# EAGLE design power (EAGLE 7.7.0)
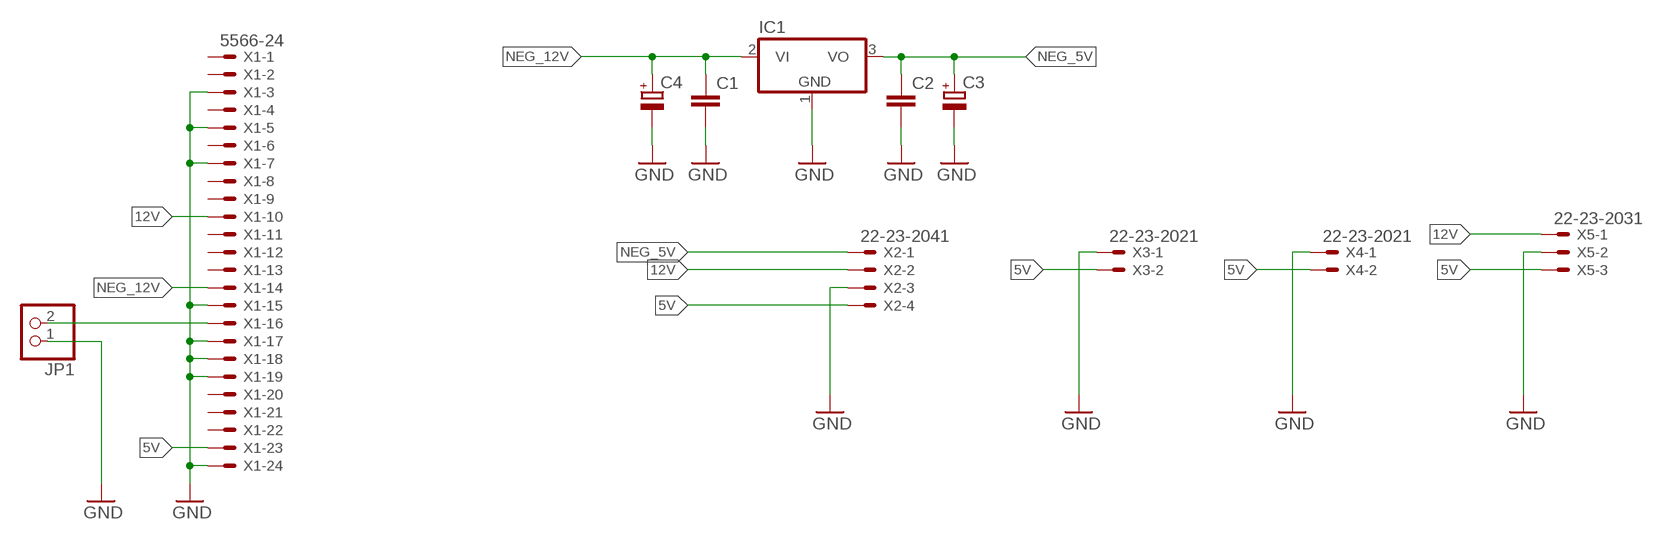
[diagram p0: schematic, sheet 1]

## Parts
C1  C-EUC1206  [C1206]
C2  C-EUC1206  [C1206]
C3  CPOL-EUSMCB  [SMC_B]
C4  CPOL-EUSMCB  [SMC_B]
IC1  7905T  [TO220H]
JP1  PINHD-1X2  [1X02]
X1  5566-24  [5566-24]
X2  22-23-2041  [22-23-2041]
X3  22-23-2021  [22-23-2021]
X4  22-23-2021  [22-23-2021]
X5  22-23-2031  [22-23-2031]

## Nets
5V: X1.23 X2.4 X3.2 X4.2 X5.3
12V: X1.10 X2.2 X5.1
GND: C1.2 C2.2 C3.- C4.- IC1.1(GND) JP1.1 X1.3 X1.5 X1.7 X1.15 X1.17 X1.18 X1.19 X1.24 X2.3 X3.1 X4.1 X5.2
N$1: JP1.2 X1.16
NEG_5V: C2.1 C3.+ IC1.3(VO) X2.1
NEG_12V: C1.1 C4.+ IC1.2(VI) X1.14
Unconnected: X1.1 X1.2 X1.4 X1.6 X1.8 X1.9 X1.11 X1.12 X1.13 X1.20 X1.21 X1.22

## Library data of the parts
C1 C2 = rcl:C-EU: CAPACITOR, European symbol
C3 C4 = rcl:CPOL-EU: POLARIZED CAPACITOR, European symbol
IC1 = linear:79*: Negative VOLTAGE REGULATOR
JP1 = pinhead:PINHD-1X2: PIN HEADER
X1 = con-molex:5566-24: Mini FIT connector 24 pol Source: http://www.molex.com; OC_FARNELL: unknown; OC_NEWARK: unknown
X2 = con-molex:22-23-2041: .100" (2.54mm) Center Header - 4 Pin; MF: MOLEX; MPN: 22-23-2041; OC_FARNELL: 1462920; OC_NEWARK: 38C0355
X3 X4 = con-molex:22-23-2021: .100" (2.54mm) Center Header - 2 Pin; MF: MOLEX; MPN: 22-23-2021; OC_FARNELL: 1462926; OC_NEWARK: 25C3832
X5 = con-molex:22-23-2031: .100" (2.54mm) Center Header - 3 Pin; MF: MOLEX; MPN: 22-23-2031; OC_FARNELL: 1462950; OC_NEWARK: 30C0862

## Board
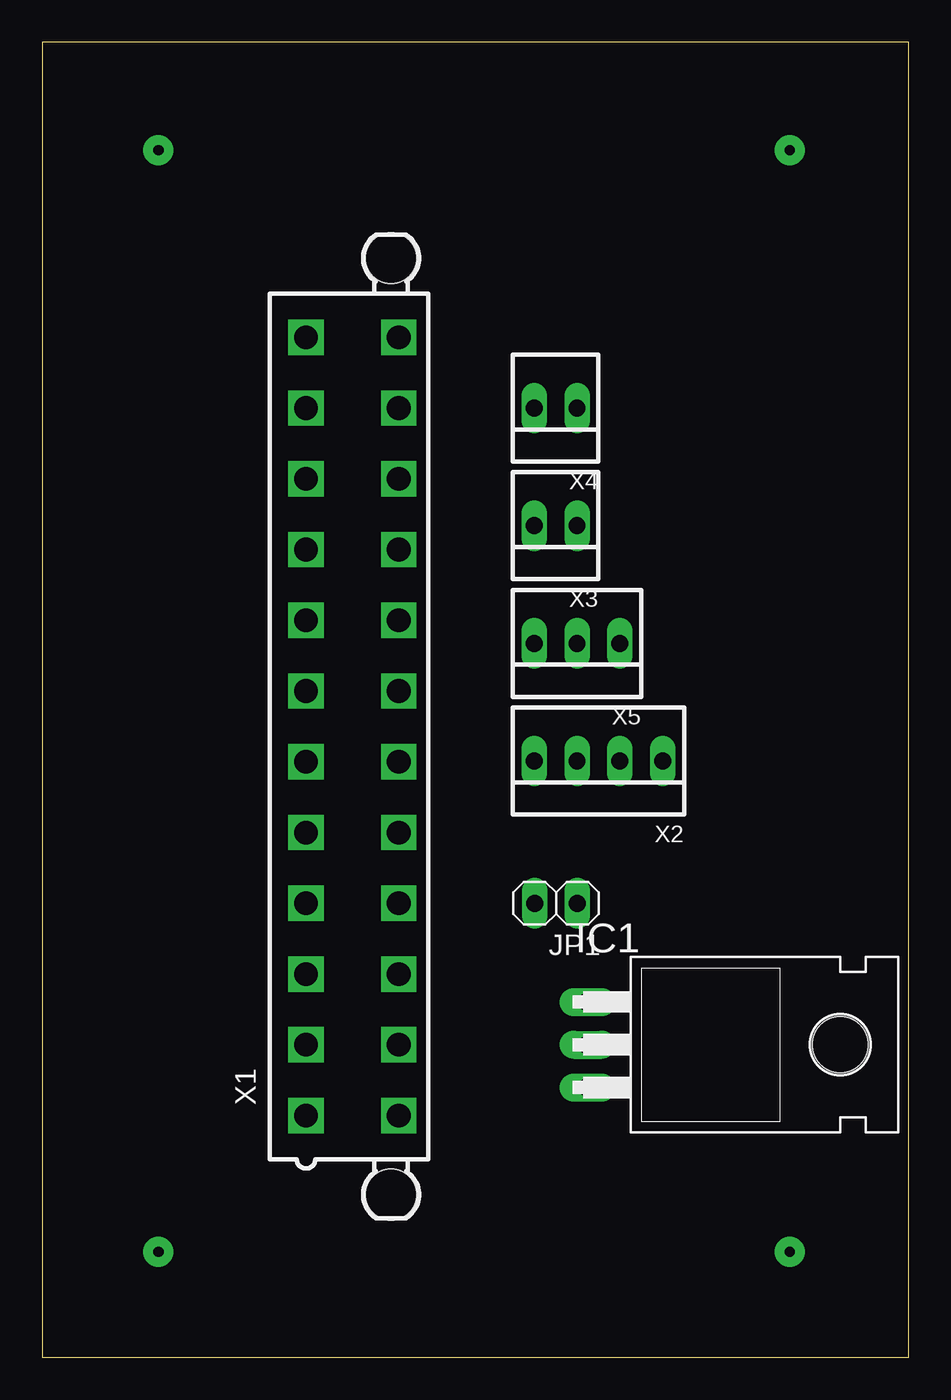
[diagram p1: board, top side]
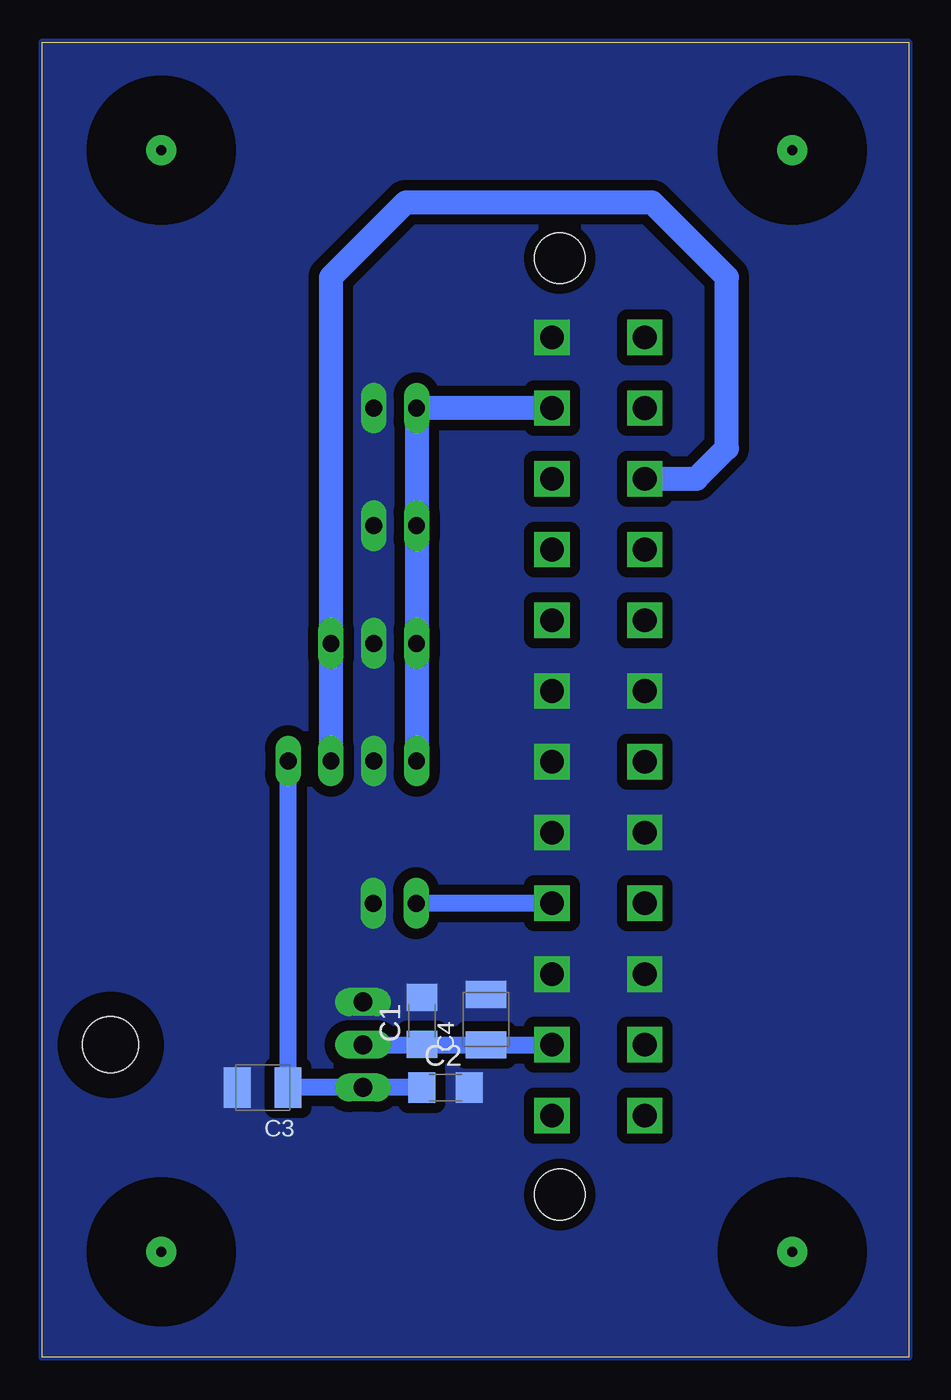
[diagram p2: board, bottom side, seen from below]

Size 51.44 x 78.09 mm. Coordinates in mm from the lower left corner, seen from the top.
Outline: 0,0 51.44,0 51.44,78.09 0,78.09 0,0
Copper layers (1*16): Top 0.035mm / dielectric 1.5mm / Bottom 0.035mm
Design rules "default *": minimum track width 10mil, minimum drill 24mil, track to track 8mil, track to pad 8mil, pad to pad 8mil, via to via 8mil, smd to smd 8mil, copper to edge 0mil, drill to drill 8mil, minimum pad ring 10mil, minimum via ring 8mil, stop-mask expansion 4mil, vias tented up to drill 0mil, thermal gap 10mil
bRestrict: area 3.1,67.9 to 10.7,75.5; area 40.6,67.9 to 48.2,75.5; area 3.1,2.5 to 10.7,10.1; area 40.6,2.5 to 48.2,10.1

### Footprints (pad centres in the part's own frame; a part is rotated, then mirrored left to right if it is on the bottom)
C1206 = smd 1.6 x 1.8: 1 -1.4,0; 2 1.4,0
SMC_B = smd 1.6 x 2.4: + -1.5,0; - 1.5,0
TO220H = drill 1.118 long: 1 -2.54,-10.16; 2 0,-10.16; 3 2.54,-10.16 | hole 3.302: 0,4.826
1X02 = drill 1.016 long: 1 -1.27,0; 2 1.27,0
5566-24 = drill 1.4 square: 1 23.1,-2.75; 2 18.9,-2.75; 3 14.7,-2.75; 4 10.5,-2.75; 5 6.3,-2.75; 6 2.1,-2.75; 7 -2.1,-2.75; 8 -6.3,-2.75; 9 -10.5,-2.75; 10 -14.7,-2.75; 11 -18.9,-2.75; 12 -23.1,-2.75; 13 23.1,2.75; 14 18.9,2.75; 15 14.7,2.75; 16 10.5,2.75; 17 6.3,2.75; 18 2.1,2.75; 19 -2.1,2.75; 20 -6.3,2.75; 21 -10.5,2.75; 22 -14.7,2.75; 23 -18.9,2.75; 24 -23.1,2.75 | hole 3: 27.8,2.29; -27.8,2.29
22-23-2041 = drill 1 long: 1 -3.81,0; 2 -1.27,0; 3 1.27,0; 4 3.81,0
22-23-2021 = drill 1 long: 1 -1.27,0; 2 1.27,0
22-23-2031 = drill 1 long: 1 -2.54,0; 2 0,0; 3 2.54,0

### Placement (x,y rotation side)
C1  28.89,19.99 90 bottom
C2  27.5,16.03 0 bottom
C3  38.34,16.03 180 bottom
C4  25.08,20.06 90 bottom
IC1  42.55,18.57 270 top
JP1  30.5,26.96 180 top
X1  18.41,37.46 270 top
X2  33.02,35.41 180 top
X3  30.48,49.38 180 top
X4  30.48,56.36 180 top
X5  31.75,42.39 180 top

### Tracks (layer width: path | path; a pad name or v marks a point on that pad's centre or on a via)
5V
  Bottom 1.422: X1.23 X4.2 X3.2 X5.3 X2.4
12V
  Bottom 1.422: X1.10 12.61,52.16 10.79,53.97 10.79,64.14 15.24,68.58 29.84,68.58 34.29,64.14 X5.1 X2.2
GND
  pour Bottom (isolate 0.61, no thermals): 0,78.11 0,0 51.44,0 51.44,78.11
N$1
  Bottom 1.016: X1.16 JP1.2
N$2  (via drill 0.6 pad 1.78)
  other vias: 44.37,71.67
N$3  (via drill 0.6 pad 1.78)
  other vias: 6.91,6.27
N$4  (via drill 0.6 pad 1.78)
  other vias: 44.37,6.27
N$23  (via drill 0.6 pad 1.78)
  other vias: 6.91,71.67
NEG_5V
  Bottom 1.016: C2.1 IC1.3 C3.+ X2.1
NEG_12V
  Bottom 1.016: IC1.2 29.21,18.57 | 29.21,18.57 25.4,18.57 | 25.4,18.57 X1.14 | C4.+ 25.4,18.56 25.4,18.57 | C1.1 29.19,18.59 29.21,18.57